# Altium schematic sheet CAR06-201EN5F.schdoc
size 127 x 101 mm
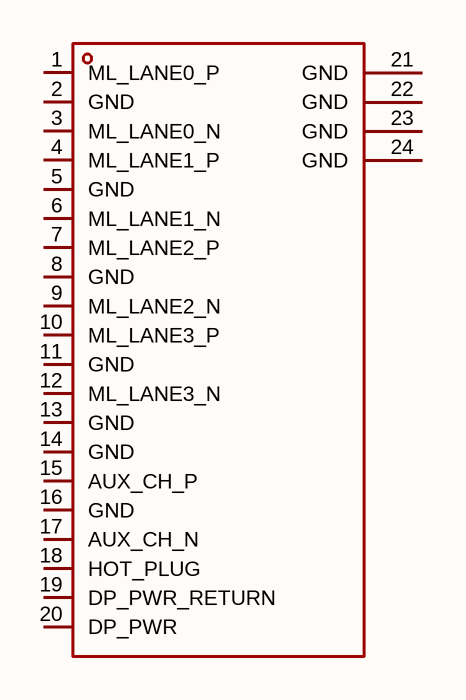
[diagram p0: CAR06-201EN5F.schdoc]

## Parts
USB?  car06-201en5f  [DP-SMD_CAR06-201EN5F]  (value not drawn)

## Nets

Not connected (* = marked no-connect by the designer): USB? 1(ML_LANE0_P) 2(GND) 3(ML_LANE0_N) 4(ML_LANE1_P) 5(GND) 6(ML_LANE1_N) 7(ML_LANE2_P) 8(GND) 9(ML_LANE2_N) 10(ML_LANE3_P) 11(GND) 12(ML_LANE3_N) 13(GND) 14(GND) 15(AUX_CH_P) 16(GND) 17(AUX_CH_N) 18(HOT_PLUG) 19(DP_PWR_RETURN) 20(DP_PWR) 21(GND) 22(GND) 23(GND) 24(GND)

## Library data of the parts
USB? = car06-201en5f: Display port连接器 母座正向平口带柱; Manufacturer: XKB Connection(中国星坤); AddInBom: yes; ModelId: 7f62c199f1984b3893a2b3b0c0c0ad9f; ModelTransform: 729.28838,592.597,0,0,0,0,0,-98.424,-74.803; Symbol: CAR06-201EN5F; LCSC Part Name: CAR06-201EN5F; SupplierPart: C908454; ManufacturerPart: CAR06-201EN5F; Supplier Footprint: SMD; JLCPCB Part Class: Extended Part; Datasheet: https://atta.szlcsc.com/upload/public/pdf/source/20211011/51ABB24801A8C5EF87749AD132E70003.pdf; Supplier: LCSC; ConvertToPcb: yes; FootprintName: DP-SMD_CAR06-201EN5F; ModelName: DP-SMD_CAR06-201EN5F